# Altium schematic sheet RF-UNIT.SCHDOC: RF-UNIT
size A4; DocumentNumber: 12; Revision: 1.9; SheetNumber: 12; SheetTotal: 18
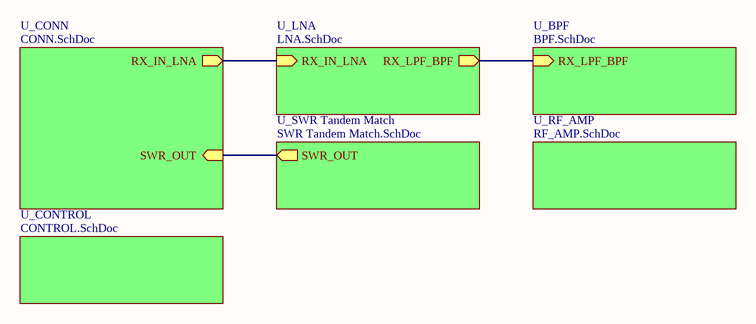
[diagram p0: RF-UNIT.SCHDOC]

## Sub-sheets
U_BPF = BPF.SchDoc: RX_LPF_BPF (in)
U_CONN = CONN.SchDoc: RX_IN_LNA (out), SWR_OUT (in)
U_CONTROL = CONTROL.SchDoc: no entries
U_LNA = LNA.SchDoc: RX_IN_LNA (in), RX_LPF_BPF (out)
U_RF_AMP = RF_AMP.SchDoc: no entries
U_SWR Tandem Match = SWR Tandem Match.SchDoc: SWR_OUT (out)

## Nets
(unnamed): sheet U_BPF/RX_LPF_BPF, sheet U_LNA/RX_LPF_BPF
(unnamed): sheet U_CONN/RX_IN_LNA, sheet U_LNA/RX_IN_LNA
(unnamed): sheet U_CONN/SWR_OUT, sheet U_SWR Tandem Match/SWR_OUT

## Notes on the sheet
- Title
- Size:
- Date:
- A4
- Number:
- Time:
- Revision:
- Sheet
- of
- File: